# Altium project PCB_Project_Oxi_VT0.1-991023.PrjPcb
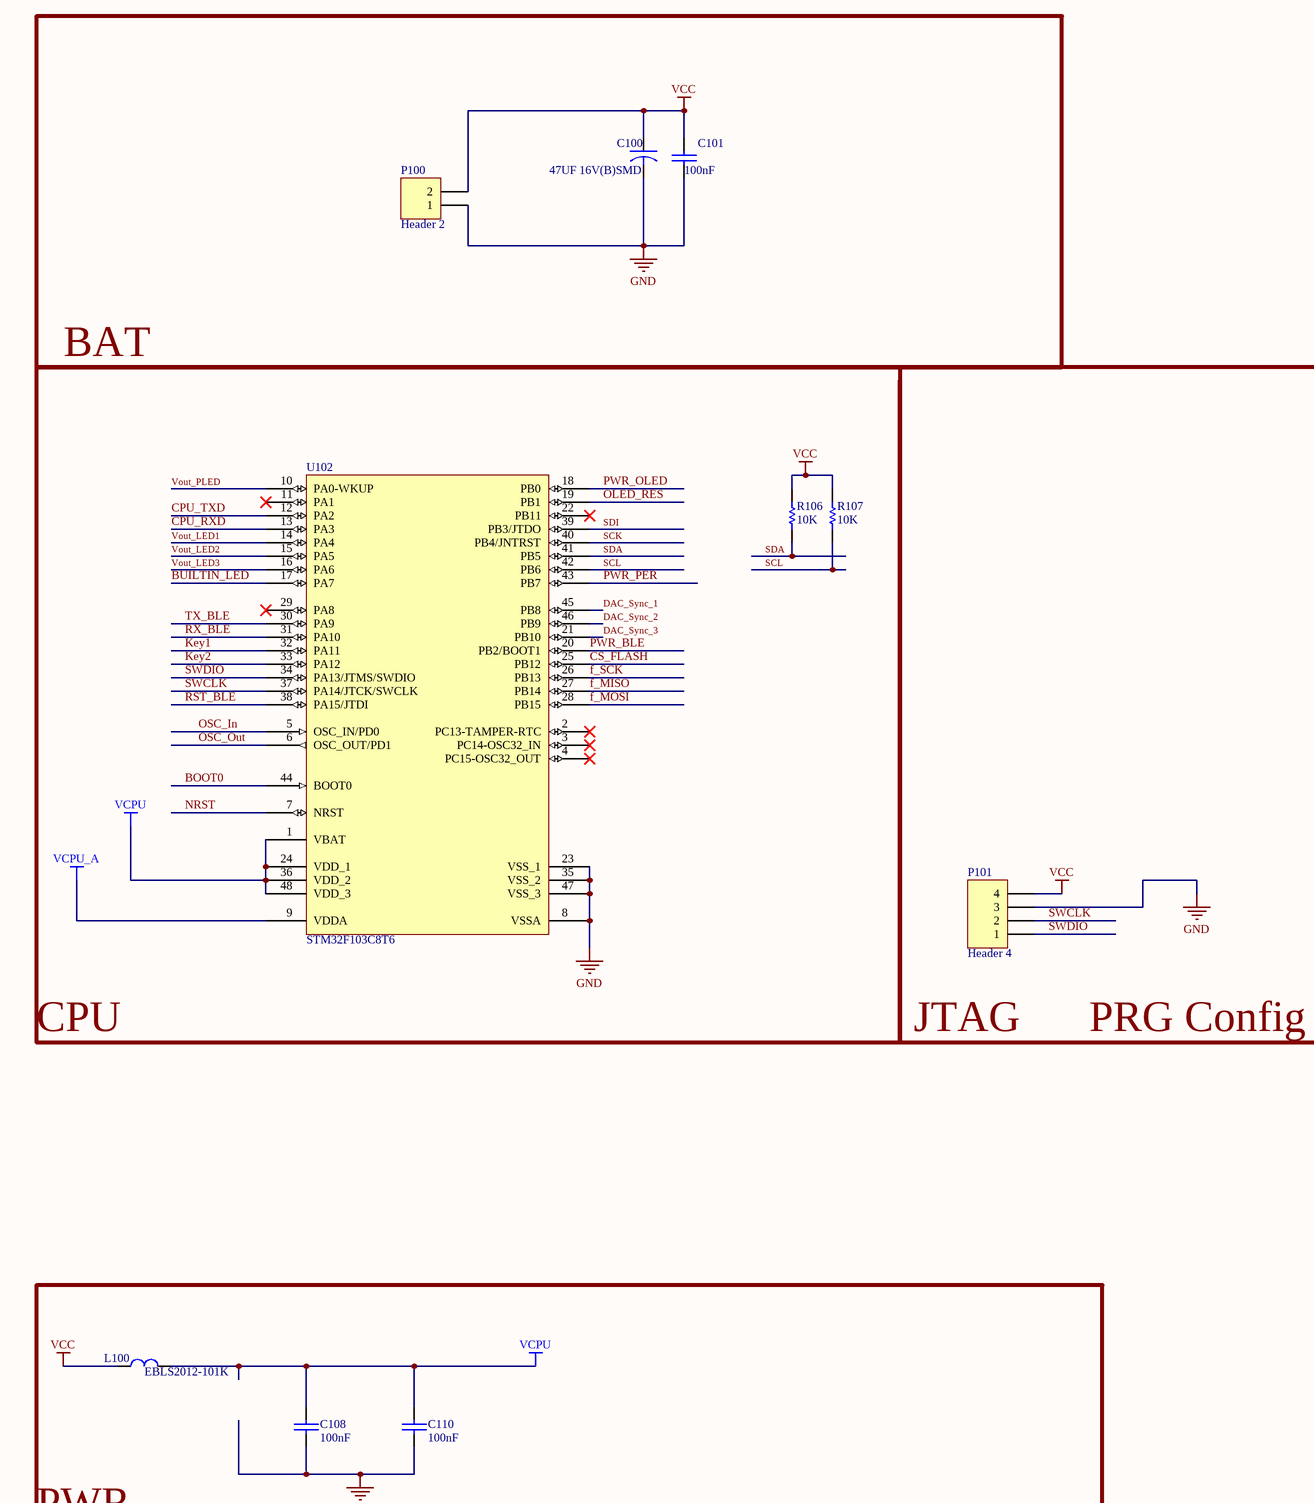
[diagram p0: MainSchematic.SchDoc, top left]
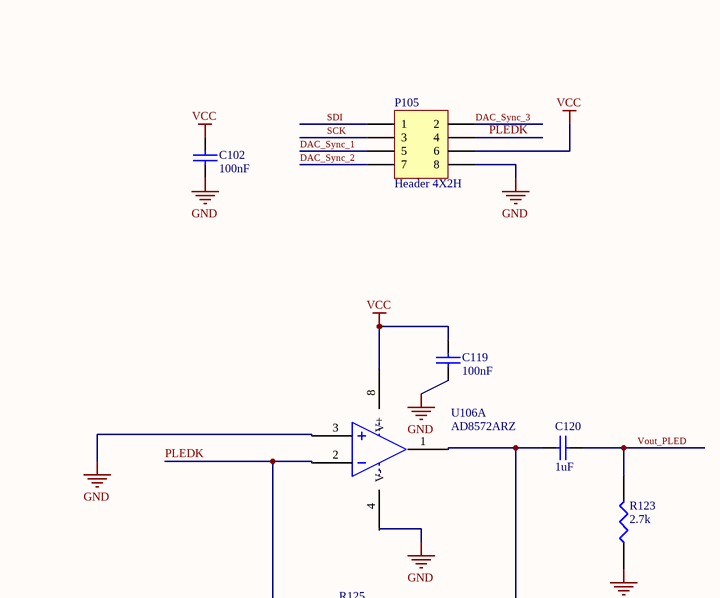
[diagram p1: MainSchematic.SchDoc, top middle]
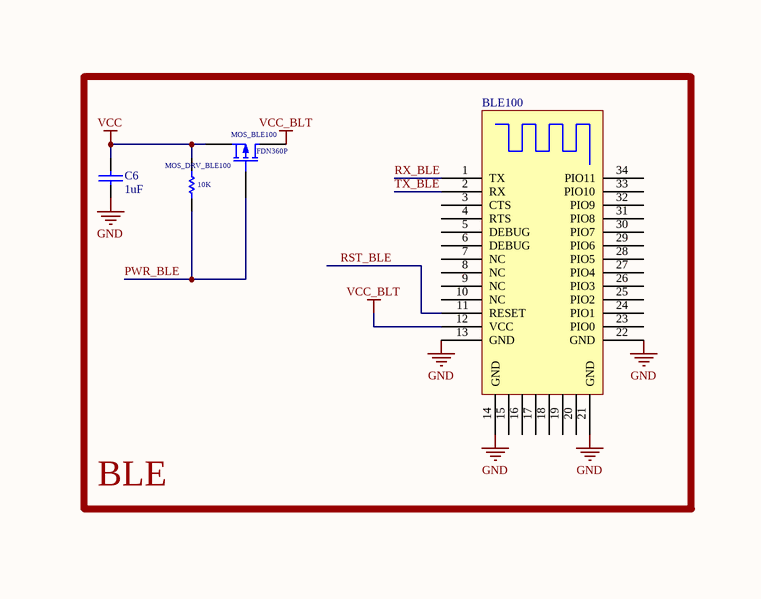
[diagram p2: MainSchematic.SchDoc, top right]
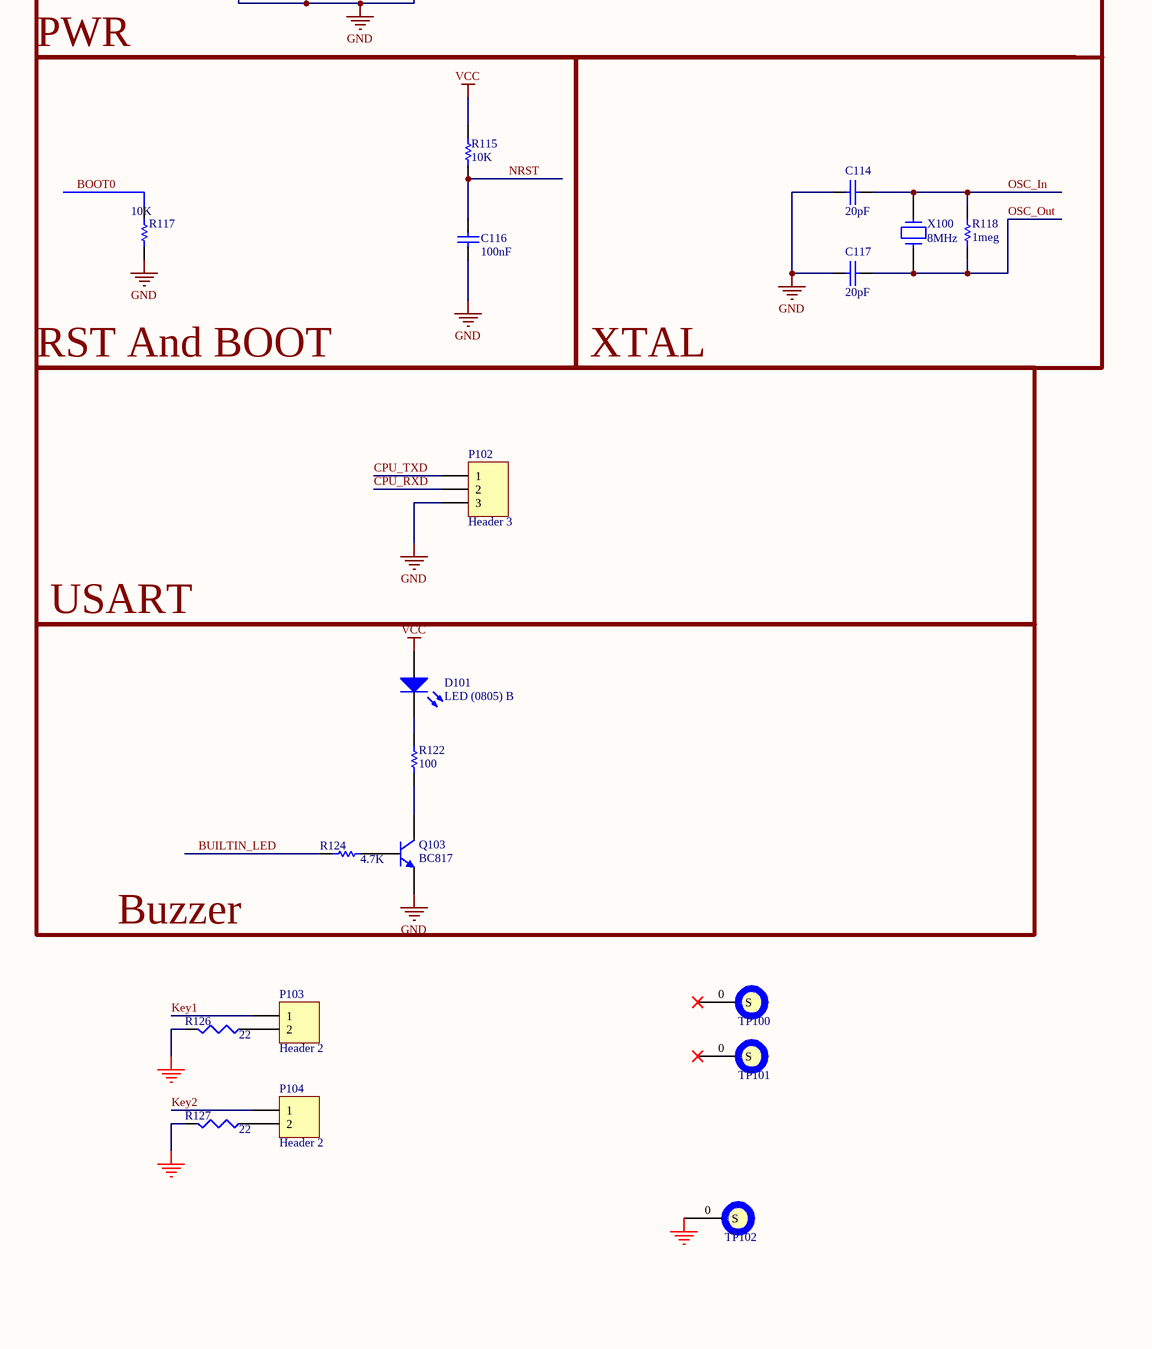
[diagram p3: MainSchematic.SchDoc, bottom left]
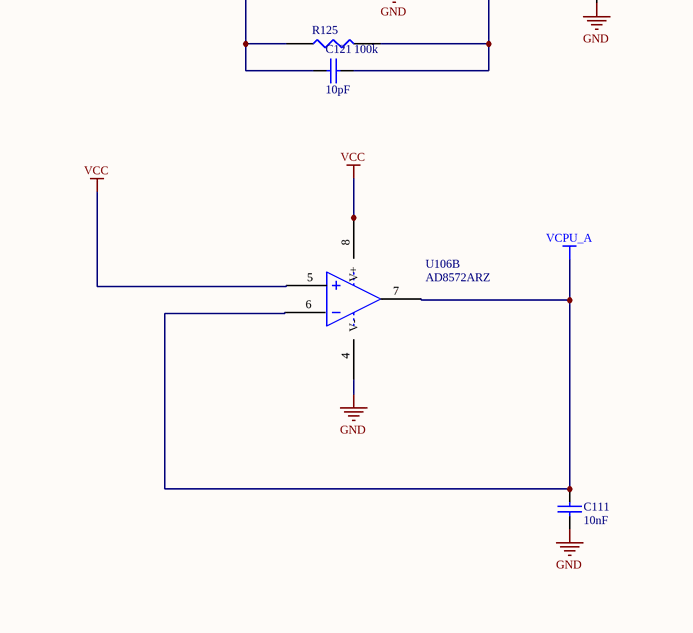
[diagram p4: MainSchematic.SchDoc, bottom middle]
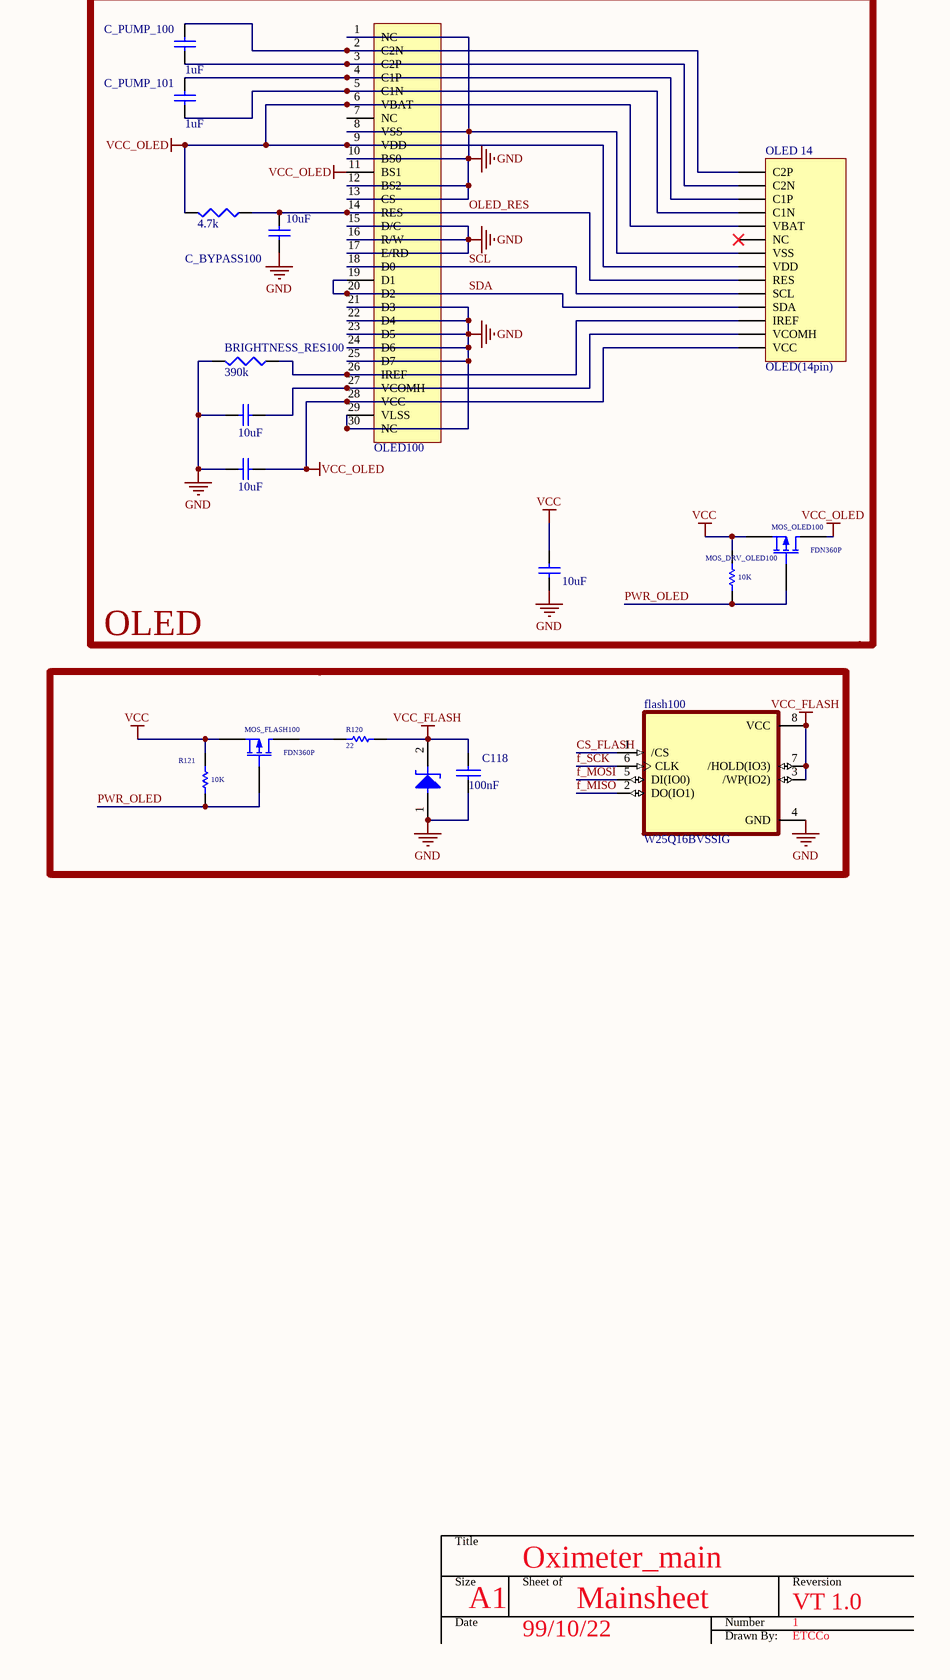
[diagram p5: MainSchematic.SchDoc, bottom right]
1 sheet, 60 parts. Net scope: global (net labels, ports and power ports of the same name join across sheets).
Board file: PCB_Oxi_VT0.1-991023.PcbDoc

## Sheet MainSchematic.SchDoc
size A1

### Parts
BLE100  HM-16  [HM-16]  (value not drawn)
BRIGHTNESS_RES100  value 390k  [0603-2]  (hidden comment: Res3)
C6  1uF  [0603-2]
C100  47UF 16V(B)SMD  [CAP-A]
C101  100nF  [0603-2]
C102  100nF  [0603-2]
C108  100nF  [0603-2]
C110  100nF  [0603-2]
C111  10nF  [0603-2]
C114  20pF  [0603-2]
C116  100nF  [0603-2]
C117  20pF  [0603-2]
C118  100nF  [0603-2]
C119  100nF  [0603-2]
C120  1uF  [0603-2]
C121  10pF  [0603-2]
C_BYPASS100  value 10uF  [0603-2]  (hidden comment: Cap Semi)
C_PUMP_100  value 1uF  [0805-2]  (hidden comment: Cap Semi)
C_PUMP_101  value 1uF  [0805-2]  (hidden comment: Cap Semi)
C_PUMP_VCMON100  value 10uF  [1206-2]  (hidden comment: Cap Semi)
D101  LED (0805) B  [0805D]
flash100  W25Q16BVSSIG  [SO-8 - editted]
L100  EBLS2012-101K  [0805-2]
MOS_BLE100  FDN360P  [SOT23_N]
MOS_DRV_BLE100  10K  [0603-2]
MOS_DRV_OLED100  10K  [0603-2]
MOS_FLASH100  FDN360P  [SOT23_N]
MOS_OLED100  FDN360P  [SOT23_N]
OLED100  OLED  [oled0.96]  (value not drawn)
OLED_14  OLED(14pin)  [oled0.91_no3d]
OLED_C_STABILITY100  value 10uF  [1206-2]  (hidden comment: Cap Semi)
OLED_C_STABILITY101  value 10uF  [1206-2]  (hidden comment: Cap Semi)
OLED_RES_PU100  value 4.7k  [0603-2]  (hidden comment: Res3)
P100  Header 2  [A_HDR1X2]
P101  Header 4  [HDR1X4]
P102  Header 3  [A_HDR1X3_editted]
P103  Header 2  [TACT-1]
P104  Header 2  [TACT-1]
P105  Header 4X2H  [HDR2X4_edited]
Q103  BC817  [SOT23]
R106  10K  [0603-2]
R107  10K  [0603-2]
R115  10K  [0603-2]
R117  10K  [0603-2]
R118  1meg  [0603-2]
R120  22  [0603-2]
R121  10K  [0603-2]
R122  100  [0603-2]
R123  2.7k  [0603-2]
R124  4.7K  [0603-2]
R125  100k  [0603-2]
R126  22  [0603-2]
R127  22  [0603-2]
TP100  HOLE  [A_Ert]  (value not drawn)
TP101  HOLE  [A_Ert]  (value not drawn)
TP102  HOLE  [TP_Net]  (value not drawn)
U102  STM32F103C8T6  [LQFP48_N]
U106  AD8572ARZ  [SO-8]  (parts A,B of 2)
X100  8MHz  [xtal]
ZEN_USB100  5V  [DSMD]  (value not drawn)

### Blocks framed on the sheet
BAT: C100 C101 P100
BLE: BLE100 C6 MOS_BLE100 MOS_DRV_BLE100
PWR: C108 C110 L100
OLED: BRIGHTNESS_RES100 C_BYPASS100 C_PUMP_100 C_PUMP_101 C_PUMP_VCMON100 MOS_DRV_OLED100 MOS_OLED100 OLED100 OLED_14 OLED_C_STABILITY100 OLED_C_STABILITY101 OLED_RES_PU100

### Nets
GND: BLE100.13(GND) BLE100.14(GND) BLE100.21(GND) BLE100.22(GND) BRIGHTNESS_RES100.2 C6.2 C100.2 C101.2 C102.2 C108.2 C110.2 C111.2 C114.2 C116.1 C117.2 C118.2 C119.2 C_BYPASS100.1 C_PUMP_VCMON100.2 flash100.4(GND) OLED100.1(NC) OLED100.8(VSS) OLED100.10(BS0) OLED100.12(BS2) OLED100.13(CS) OLED100.15(D/C) OLED100.16(R/W) OLED100.17(E/RD) OLED100.21(D3) OLED100.22(D4) OLED100.23(D5) OLED100.24(D6) OLED100.25(D7) OLED100.29(VLSS) OLED100.30(NC) OLED_14.7(VSS) OLED_C_STABILITY100.2 OLED_C_STABILITY101.2 P100.1 P101.3 P102.3 P105.8 Q103.2(E) R117.2 R123.1 R126.2 R127.2 TP102.0(S) U102.8(VSSA) U102.23(VSS_1) U102.35(VSS_2) U102.47(VSS_3) U106.3(IN+) U106.4(V-) ZEN_USB100.1
VCC: C6.1 C100.1 C101.1 C102.1 C119.1 D101.1(A) L100.1 MOS_BLE100.2(S) MOS_DRV_BLE100.1 MOS_DRV_OLED100.1 MOS_FLASH100.2(S) MOS_OLED100.2(S) OLED_C_STABILITY101.1 P100.2 P101.4 P105.6 R106.1 R107.1 R115.2 R121.1 U106.5(IN+) U106.8(V+)
VCC_BLT: BLE100.12(VCC) MOS_BLE100.3(D)
VCC_FLASH: C118.1 flash100.3(/WP(IO2)) flash100.7(/HOLD(IO3)) flash100.8(VCC) R120.2 ZEN_USB100.2
VCC_OLED: MOS_OLED100.3(D) OLED100.6(VBAT) OLED100.9(VDD) OLED100.28(VCC) OLED_14.5(VBAT) OLED_14.8(VDD) OLED_14.14(VCC) OLED_C_STABILITY100.1 OLED_RES_PU100.2
VCPU: C108.1 C110.1 L100.2 U102.1(VBAT) U102.24(VDD_1) U102.36(VDD_2) U102.48(VDD_3)
VCPU_A: C111.1 U102.9(VDDA) U106.6(IN-) U106.7(OUT)
BOOT0: R117.1 U102.44(BOOT0)
BUILTIN_LED: R124.2 U102.17(PA7)
CPU_RXD: P102.2 U102.13(PA3)
CPU_TXD: P102.1 U102.12(PA2)
CS_FLASH: flash100.1(/CS) U102.25(PB12)
DAC_Sync_1: P105.5 U102.45(PB8)
DAC_Sync_2: P105.7 U102.46(PB9)
DAC_Sync_3: P105.2 U102.21(PB10)
f_MISO: flash100.2(DO(IO1)) U102.27(PB14)
f_MOSI: flash100.5(DI(IO0)) U102.28(PB15)
f_SCK: flash100.6(CLK) U102.26(PB13)
Key1: P103.1 U102.32(PA11)
Key2: P104.1 U102.33(PA12)
NRST: C116.2 R115.1 U102.7(NRST)
OLED_RES: C_BYPASS100.2 OLED100.14(RES) OLED_14.9(RES) OLED_RES_PU100.1 U102.19(PB1)
OSC_In: C114.1 R118.1 U102.5(OSC_IN/PD0) X100.2
OSC_Out: C117.1 R118.2 U102.6(OSC_OUT/PD1) X100.1
PLEDK: C121.1 P105.4 R125.1 U106.2(IN-)
PWR_BLE: MOS_BLE100.1(G) MOS_DRV_BLE100.2 U102.20(PB2/BOOT1)
PWR_OLED: MOS_DRV_OLED100.2 MOS_FLASH100.1(G) MOS_OLED100.1(G) R121.2 U102.18(PB0)
PWR_PER: U102.43(PB7)
RST_BLE: BLE100.11(RESET) U102.38(PA15/JTDI)
RX_BLE: BLE100.1(TX) U102.31(PA10)
SCK: P105.3 U102.40(PB4/JNTRST)
SCL: OLED100.18(D0) OLED_14.10(SCL) R107.2 U102.42(PB6)
SDA: OLED100.19(D1) OLED100.20(D2) OLED_14.11(SDA) R106.2 U102.41(PB5)
SDI: P105.1 U102.39(PB3/JTDO)
SWCLK: P101.2 U102.37(PA14/JTCK/SWCLK)
SWDIO: P101.1 U102.34(PA13/JTMS/SWDIO)
TX_BLE: BLE100.2(RX) U102.30(PA9)
Vout_LED1: U102.14(PA4)
Vout_LED2: U102.15(PA5)
Vout_LED3: U102.16(PA6)
Vout_PLED: C120.2 R123.2 U102.10(PA0-WKUP)
NetBRIGHTNESS_RES100_1: BRIGHTNESS_RES100.1 OLED100.26(IREF) OLED_14.12(IREF)
NetC120_1: C120.1 C121.2 R125.2 U106.1(OUT)
NetC_PUMP_100_1: C_PUMP_100.1 OLED100.3(C2P) OLED_14.2(C2N)
NetC_PUMP_100_2: C_PUMP_100.2 OLED100.2(C2N) OLED_14.1(C2P)
NetC_PUMP_101_1: C_PUMP_101.1 OLED100.5(C1N) OLED_14.4(C1N)
NetC_PUMP_101_2: C_PUMP_101.2 OLED100.4(C1P) OLED_14.3(C1P)
NetC_PUMP_VCMON100_1: C_PUMP_VCMON100.1 OLED100.27(VCOMH) OLED_14.13(VCOMH)
NetD101_2: D101.2(K) R122.1
NetMOS_FLASH100_3: MOS_FLASH100.3(D) R120.1
NetP103_2: P103.2 R126.1
NetP104_2: P104.2 R127.1
NetQ103_1: Q103.1(B) R124.1
NetQ103_3: Q103.3(C) R122.2

Not connected (* = marked no-connect by the designer): BLE100 3(CTS) 4(RTS) 5(DEBUG) 6(DEBUG) 7(NC) 8(NC) 9(NC) 10(NC) 15 16 17 18 19 20 23(PIO0) 24(PIO1) 25(PIO2) 26(PIO3) 27(PIO4) 28(PIO5) 29(PIO6) 30(PIO7) 31(PIO8) 32(PIO9) 33(PIO10) 34(PIO11); OLED100 7(NC) 11(BS1); OLED_14 6(NC)*; TP100 0(S)*; TP101 0(S)*; U102 2(PC13-TAMPER-RTC)* 3(PC14-OSC32_IN)* 4(PC15-OSC32_OUT)* 11(PA1)* 22(PB11)* 29(PA8)*

### Notes on the sheet
- CPU
- JTAG
- PRG Config
- RST And BOOT
- XTAL
- USART
- Buzzer
- Title
- Oximeter_main
- Size
- Date
- A1
- Sheet of
- 99/10/22
- Mainsheet
- Number
- Drawn By:
- Reversion
- ETCCo
- VT 1.0
- 1
- Labels drawn without touching a wire or pin: VCC_OLED

### Library data of the parts
BRIGHTNESS_RES100 OLED_RES_PU100 = Res3: Resistor; Published: 8-Jun-2000; LatestRevisionDate: 29-May-2009; LatestRevisionNote: IPC-7351 Footprint Added.; PackageReference: J1-0603; Publisher: Altium Limited; PackageDescription: Chip Resistor
C6 C101 C102 C108 C110 C111 C114 C117-C121 = CAP: Capacitor
C100 = CAPACITOR: TAJD106M035RNJ
C116 = CAP: Capacitor; Value: 100pF; Published: 8-Jun-2000; Revision: July-2002: Re-released for DXP Platform.; Publisher: Altium Limited
C_BYPASS100 C_PUMP_100 C_PUMP_101 C_PUMP_VCMON100 OLED_C_STABILITY100 OLED_C_STABILITY101 = Cap Semi: Capacitor (Semiconductor SIM Model); Published: 8-Jun-2000; LatestRevisionDate: 29-May-2009; LatestRevisionNote: IPC-7351 Footprint Added.; PackageReference: C1206; Publisher: Altium Limited; PackageDescription: Chip Capacitor
D101 = LED3: Typical BLUE SiC LED; Published: 8-Jun-2000; LatestRevisionDate: 17-Dec-2003; LatestRevisionNote: PCB Footprint replaced.; DatasheetDocument: 16-Apr-2002; PackageDocument: 16-Apr-2002; PackageReference: 3.5X2.8X1.9; Publisher: Altium Limited
flash100 = W25Q16BVSSIG: FLASH - NOR Memory IC 16Mb _2M x 8_ SPI 104MHz 8-SOIC; MF: Winbond; Availability: Unavailable; MP: W25Q16BVSSIG; SnapEDA_Link: https://www.snapeda.com/parts/W25Q16BVSSIG/Winbond%20Electronics/view-part/512685/?ref=snap; Value: *; Price: None; Package: SOIC-8 Winbond
L100 = INDUCTOR: Inductor 100UH (0805); GLFR1608T100M-LR: 10UH
MOS_BLE100 MOS_FLASH100 MOS_OLED100 = MOSFET-P: P-Channel MOSFET; Published: 8-Jun-2000; LatestRevisionDate: 17-Jul-2002; LatestRevisionNote: Re-released for DXP Platform.; PackageVersion: 1995/1996; PackageReference: E3; Publisher: Altium Limited; PackageDescription: TO, Flat Index; 3 In-Line, Axial Leads; Body Dia. 4.6mm; Lead Dia. 0.5 mm (max)
MOS_DRV_BLE100 MOS_DRV_OLED100 R115 R120 R121 = res1: Resistor; Value: 1K; Published: 8-Jun-2000; Revision: July-2002: Re-released for DXP Platform.; Publisher: Altium Limited
OLED100 = OLED0.96
P100 P103 P104 = Header 2: Header, 2-Pin; LatestRevisionDate: 17-Jul-2002; LatestRevisionNote: Re-released for DXP Platform.; Publisher: Altium Limited
P101 = Header 4: Header, 4-Pin; LatestRevisionDate: 17-Jul-2002; LatestRevisionNote: Re-released for DXP Platform.; Publisher: Altium Limited
P102 = Header 3: Header, 3-Pin; LatestRevisionDate: 17-Jul-2002; LatestRevisionNote: Re-released for DXP Platform.; Publisher: Altium Limited
P105 = Header 4X2H: Header, 4-Pin, Dual row, Right Angle; LatestRevisionDate: 17-Jul-2002; LatestRevisionNote: Re-released for DXP Platform.; Publisher: Altium Limited
Q103 = 2N3904: NPN General Purpose Amplifier; Published: 8-Jun-2000; LatestRevisionDate: 15-Jan-2003; LatestRevisionNote: PCB Footprint 'BCY-W3/D4.7' replaced; DatasheetVersion: 1997; PackageVersion: Sep-1998; PackageReference: TO-92A; Publisher: Altium Limited; PackageDescription: TO, Flat Index; 3 In-Line, Axial Leads; Body Dia. 4.5mm; Leads 0.51 x 0.48 mm (max); ComponentLink1Description: Manufacturer Link; ComponentLink1URL: http://www.fairchildsemi.com/; ComponentLink2Description: Datasheet; ComponentLink2URL: http://www.fairchildsemi.com/ds/2N%2F2N3904.pdf
R106 R107 R117 R118 R122 R124 = Res1: Resistor; Value: 1K; Published: 8-Jun-2000; Revision: July-2002: Re-released for DXP Platform.; Publisher: Altium Limited
R123 R125-R127 = RES1
TP100-TP102 = TP
U102 = STM32F103C8T6: STM32 ARM-based 32-bit MCU with 64 Kbytes Flash, 48-pin LQFP, Industrial Temperature; Published: *; DatasheetVersion: *; PackageVersion: *; PackageReference: *; Publisher: *; PackageDescription: *; ComponentLink1Description: *; ComponentLink1URL: *; ComponentLink2Description: *; ComponentLink2URL: *
U106 = NJM3404
X100 = CRYSTAL: NTK-8.000000-HC49US
ZEN_USB100 = ZENER